# Altium schematic sheet EVK-IRIS-W1-FC2_FC3_FC14_RMII.SchDoc
size A3; DocumentNumber: 5; SheetNumber: 5; SheetTotal: 14
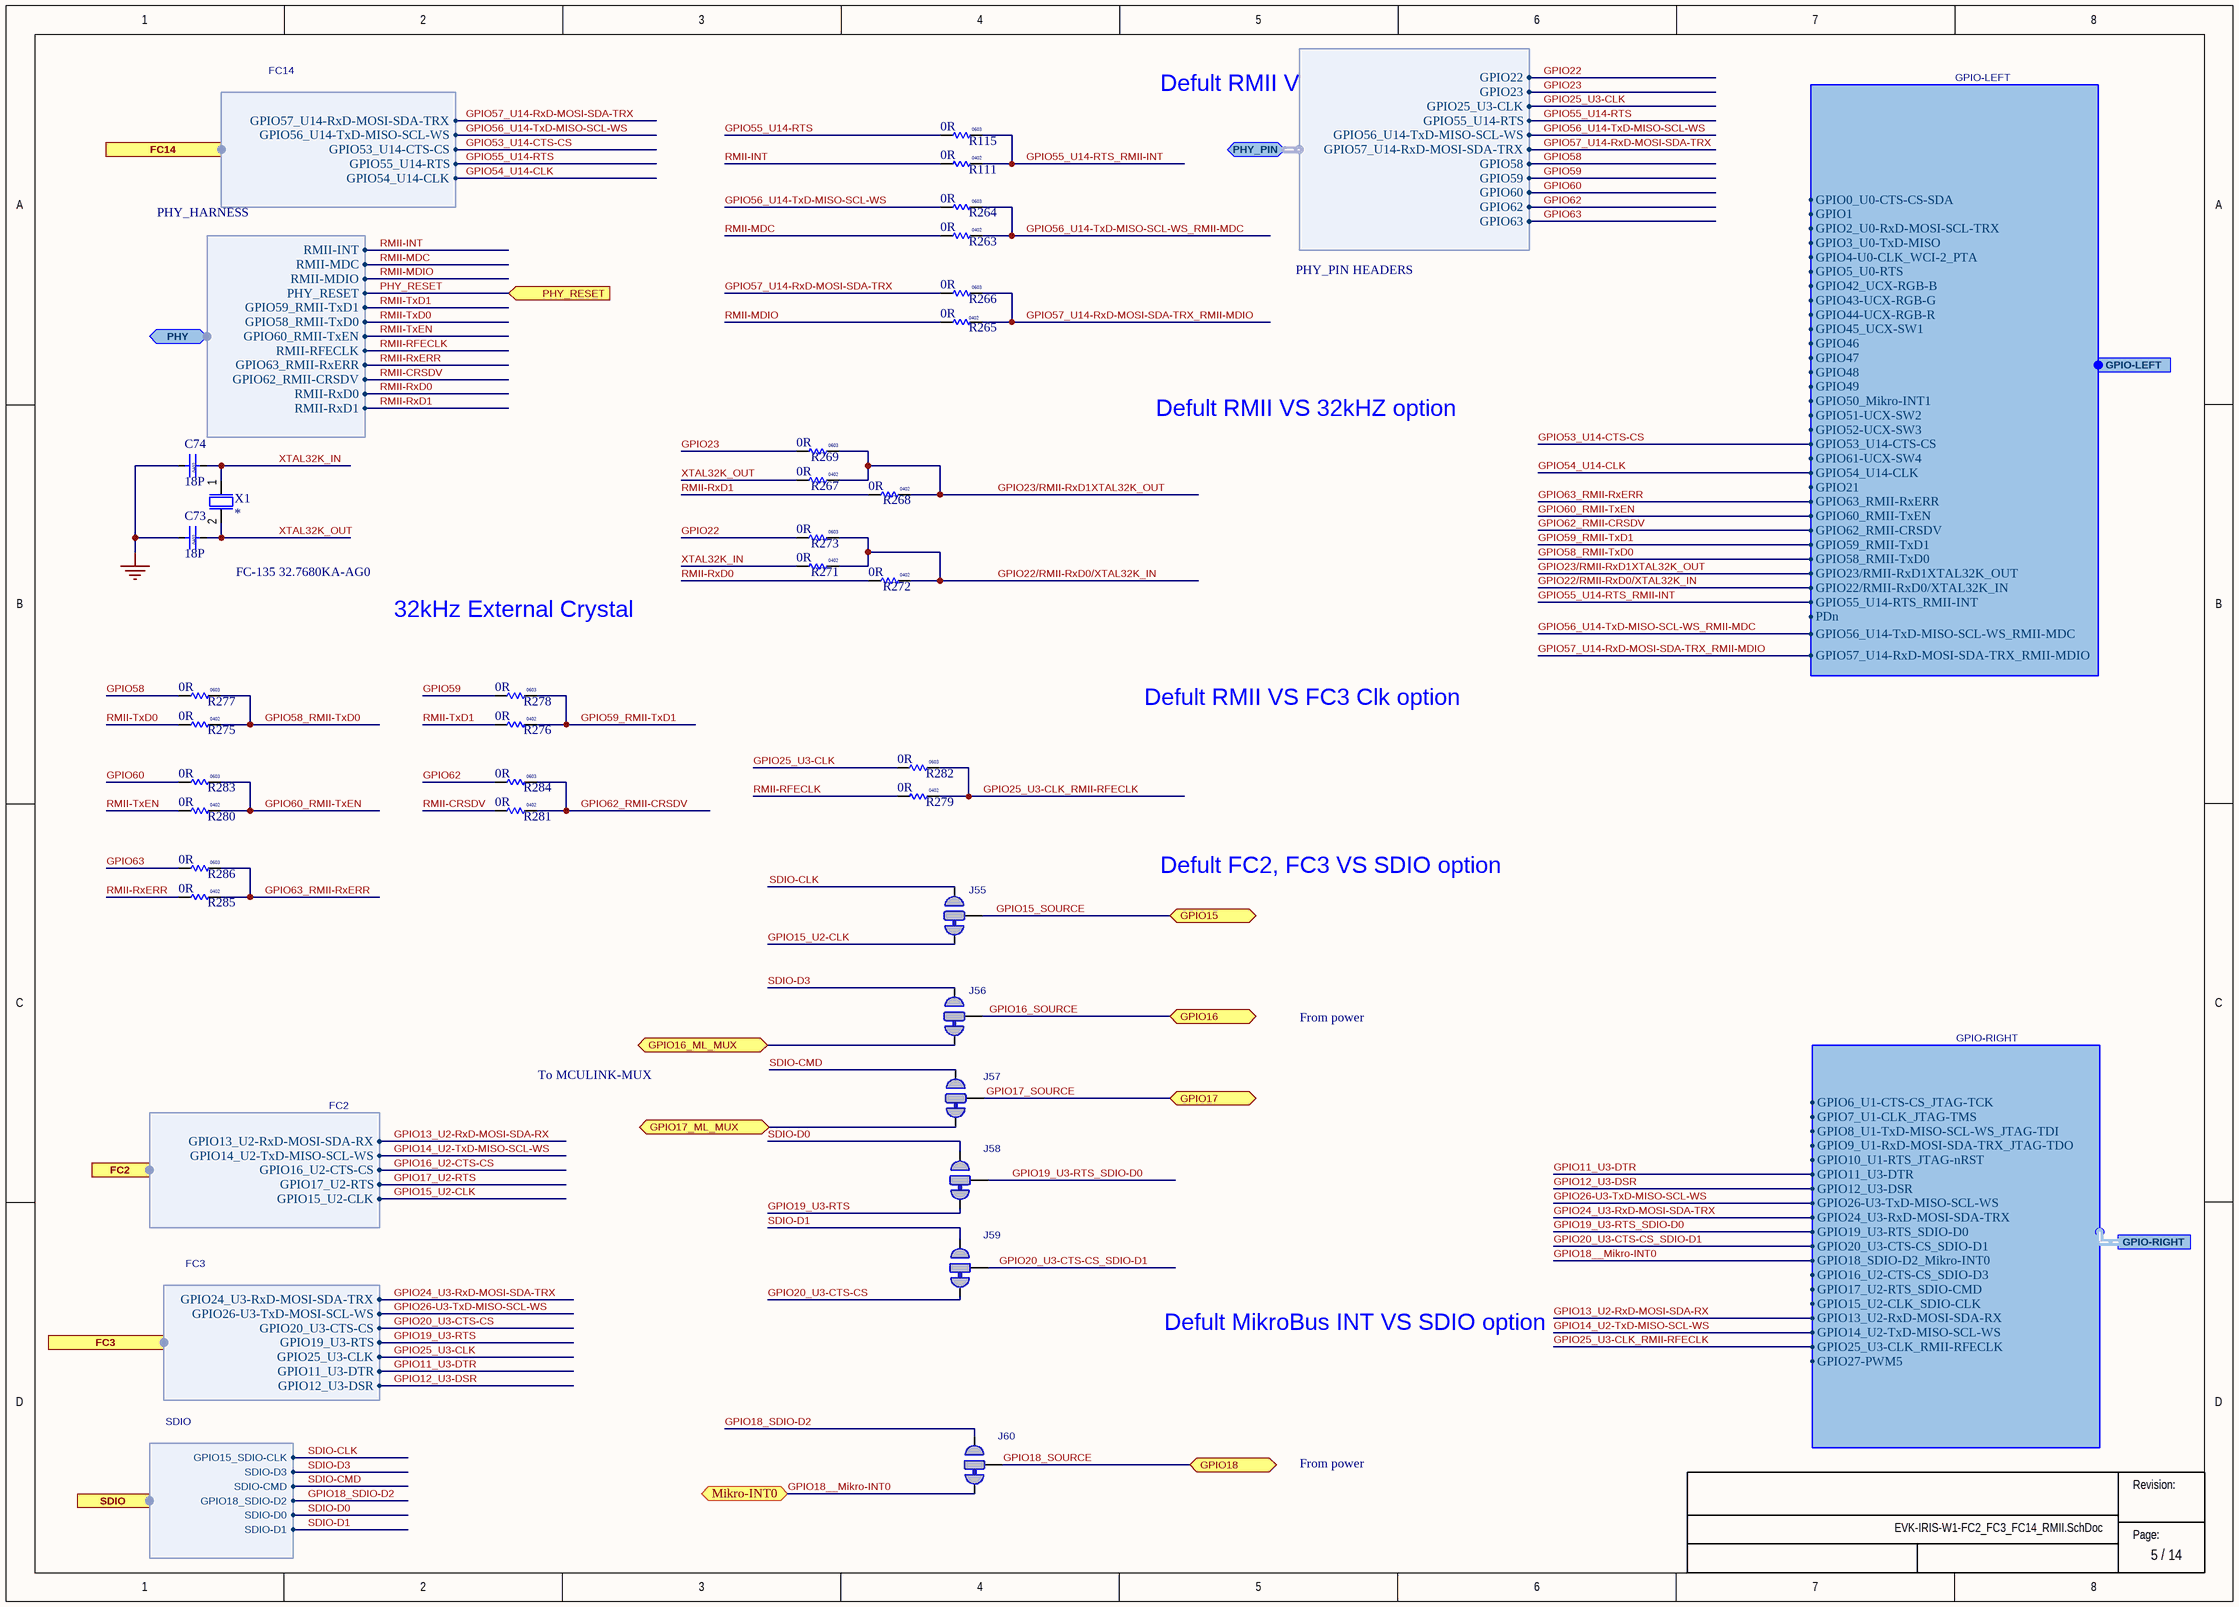
[diagram p0: EVK-IRIS-W1-FC2_FC3_FC14_RMII.SchDoc]

## Parts
C73  value 18P  Size: 0402  [Cap 0402]
C74  value 18P  Size: 0402  [Cap 0402]
J55  Solderbridge-OptionDNP  [Solderbridge-Option]  (value not drawn)  (net tie, no BOM)
J56  Solderbridge-OptionDNP  [Solderbridge-Option]  (value not drawn)  (net tie, no BOM)
J57  Solderbridge-OptionDNP  [Solderbridge-Option]  (value not drawn)  (net tie, no BOM)
J58  Solderbridge-OptionDNP  [Solderbridge-Option]  (value not drawn)  (net tie, no BOM)
J59  Solderbridge-OptionDNP  [Solderbridge-Option]  (value not drawn)  (net tie, no BOM)
J60  Solderbridge-OptionDNP  [Solderbridge-Option]  (value not drawn)  (net tie, no BOM)
R111  value 0R  Size: 0402  [RES 0402 HD]
R115  value 0R  Size: 0603  [RES 0603 HD]
R263  value 0R  Size: 0402  [RES 0402 HD]
R264  value 0R  Size: 0603  [RES 0603 HD]
R265  value 0R  Size: 0402  [RES 0402 HD]
R266  value 0R  Size: 0603  [RES 0603 HD]
R267  value 0R  Size: 0402  [RES 0402 HD]
R268  value 0R  Size: 0402  [RES 0402 HD]
R269  value 0R  Size: 0603  [RES 0603 HD]
R271  value 0R  Size: 0402  [RES 0402 HD]
R272  value 0R  Size: 0402  [RES 0402 HD]
R273  value 0R  Size: 0603  [RES 0603 HD]
R275  value 0R  Size: 0402  [RES 0402 HD]
R276  value 0R  Size: 0402  [RES 0402 HD]
R277  value 0R  Size: 0603  [RES 0603 HD]
R278  value 0R  Size: 0603  [RES 0603 HD]
R279  value 0R  Size: 0402  [RES 0402 HD]
R280  value 0R  Size: 0402  [RES 0402 HD]
R281  value 0R  Size: 0402  [RES 0402 HD]
R282  value 0R  Size: 0603  [RES 0603 HD]
R283  value 0R  Size: 0603  [RES 0603 HD]
R284  value 0R  Size: 0603  [RES 0603 HD]
R285  value 0R  Size: 0402  [RES 0402 HD]
R286  value 0R  Size: 0603  [RES 0603 HD]
X1  (no value)  [XTAL_3215]

## Ports
FC2 (harness FC2), FC3 (harness FC3), FC14 (harness FC14), GPIO15 (bidir), GPIO16 (bidir), GPIO16_ML_MUX (bidir), GPIO17 (bidir), GPIO17_ML_MUX (bidir), GPIO18 (bidir), GPIO-LEFT (harness GPIO-LEFT), GPIO-RIGHT (harness GPIO-RIGHT), Mikro-INT0 (bidir), PHY (bidir, harness PHY_HARNESS), PHY_PIN (bidir, harness PHY_PIN HEADERS), PHY_RESET (in), SDIO (harness SDIO)

## Harnesses
GPIO-RIGHT: GPIO6_U1-CTS-CS_JTAG-TCK, GPIO7_U1-CLK_JTAG-TMS, GPIO8_U1-TxD-MISO-SCL-WS_JTAG-TDI, GPIO9_U1-RxD-MOSI-SDA-TRX_JTAG-TDO, GPIO10_U1-RTS_JTAG-nRST, GPIO11_U3-DTR, GPIO12_U3-DSR, GPIO26-U3-TxD-MISO-SCL-WS, GPIO24_U3-RxD-MOSI-SDA-TRX, GPIO19_U3-RTS_SDIO-D0, GPIO20_U3-CTS-CS_SDIO-D1, GPIO18_SDIO-D2_Mikro-INT0, GPIO16_U2-CTS-CS_SDIO-D3, GPIO17_U2-RTS_SDIO-CMD, GPIO15_U2-CLK_SDIO-CLK, GPIO13_U2-RxD-MOSI-SDA-RX, GPIO14_U2-TxD-MISO-SCL-WS, GPIO25_U3-CLK_RMII-RFECLK, GPIO27-PWM5
PHY_HARNESS: RMII-MDIO, RMII-MDC, PHY_RESET, RMII-INT, GPIO59_RMII-TxD1, GPIO58_RMII-TxD0, GPIO60_RMII-TxEN, RMII-RFECLK, GPIO63_RMII-RxERR, GPIO62_RMII-CRSDV, RMII-RxD0, RMII-RxD1
FC14: GPIO57_U14-RxD-MOSI-SDA-TRX, GPIO56_U14-TxD-MISO-SCL-WS, GPIO53_U14-CTS-CS, GPIO55_U14-RTS, GPIO54_U14-CLK
SDIO: GPIO15_SDIO-CLK, SDIO-D3, SDIO-CMD, GPIO18_SDIO-D2, SDIO-D0, SDIO-D1
FC2: GPIO13_U2-RxD-MOSI-SDA-RX, GPIO14_U2-TxD-MISO-SCL-WS, GPIO16_U2-CTS-CS, GPIO17_U2-RTS, GPIO15_U2-CLK
FC3: GPIO20_U3-CTS-CS, GPIO19_U3-RTS, GPIO24_U3-RxD-MOSI-SDA-TRX, GPIO26-U3-TxD-MOSI-SCL-WS, GPIO25_U3-CLK, GPIO11_U3-DTR, GPIO12_U3-DSR
GPIO-LEFT: GPIO0_U0-CTS-CS-SDA, GPIO1, GPIO2_U0-RxD-MOSI-SCL-TRX, GPIO3_U0-TxD-MISO, GPIO4-U0-CLK_WCI-2_PTA, GPIO5_U0-RTS, GPIO42_UCX-RGB-B, GPIO43-UCX-RGB-G, GPIO44-UCX-RGB-R, GPIO45_UCX-SW1, GPIO46, GPIO47, GPIO48, GPIO49, GPIO50_Mikro-INT1, GPIO51-UCX-SW2, GPIO52-UCX-SW3, GPIO53_U14-CTS-CS, GPIO61-UCX-SW4, GPIO54_U14-CLK, GPIO21, GPIO63_RMII-RxERR, GPIO60_RMII-TxEN, GPIO62_RMII-CRSDV, GPIO59_RMII-TxD1, GPIO58_RMII-TxD0, GPIO23/RMII-RxD1XTAL32K_OUT, GPIO22/RMII-RxD0/XTAL32K_IN, GPIO55_U14-RTS_RMII-INT, PDn, GPIO56_U14-TxD-MISO-SCL-WS_RMII-MDC, GPIO57_U14-RxD-MOSI-SDA-TRX_RMII-MDIO
PHY_PIN HEADERS: GPIO22, GPIO23, GPIO25_U3-CLK, GPIO55_U14-RTS, GPIO56_U14-TxD-MISO-SCL-WS, GPIO57_U14-RxD-MOSI-SDA-TRX, GPIO58, GPIO59, GPIO60, GPIO62, GPIO63

## Nets
GND: C73.2 C74.2
GPIO11_U3-DTR: port GPIO-RIGHT.GPIO11_U3-DTR, port FC3.GPIO11_U3-DTR
GPIO12_U3-DSR: port GPIO-RIGHT.GPIO12_U3-DSR, port FC3.GPIO12_U3-DSR
GPIO13_U2-RxD-MOSI-SDA-RX: port GPIO-RIGHT.GPIO13_U2-RxD-MOSI-SDA-RX, port FC2.GPIO13_U2-RxD-MOSI-SDA-RX
GPIO14_U2-TxD-MISO-SCL-WS: port GPIO-RIGHT.GPIO14_U2-TxD-MISO-SCL-WS, port FC2.GPIO14_U2-TxD-MISO-SCL-WS
GPIO15_SOURCE: J55.2 ; port GPIO15
GPIO15_U2-CLK: J55.1 ; port FC2.GPIO15_U2-CLK
GPIO16_ML_MUX: J56.1 ; port GPIO16_ML_MUX
GPIO16_SOURCE: J56.2 ; port GPIO16
GPIO16_U2-CTS-CS: port FC2.GPIO16_U2-CTS-CS
GPIO17_ML_MUX: J57.1 ; port GPIO17_ML_MUX
GPIO17_SOURCE: J57.2 ; port GPIO17
GPIO17_U2-RTS: port FC2.GPIO17_U2-RTS
GPIO18__Mikro-INT0: J60.1 ; port Mikro-INT0, port GPIO-RIGHT.GPIO18_SDIO-D2_Mikro-INT0
GPIO18_SDIO-D2: J60.3 ; port SDIO.GPIO18_SDIO-D2
GPIO18_SOURCE: J60.2 ; port GPIO18
GPIO19_U3-RTS: J58.1 ; port FC3.GPIO19_U3-RTS
GPIO19_U3-RTS_SDIO-D0: J58.2 ; port GPIO-RIGHT.GPIO19_U3-RTS_SDIO-D0
GPIO20_U3-CTS-CS: J59.1 ; port FC3.GPIO20_U3-CTS-CS
GPIO20_U3-CTS-CS_SDIO-D1: J59.2 ; port GPIO-RIGHT.GPIO20_U3-CTS-CS_SDIO-D1
GPIO22: R273.1 ; port PHY_PIN.GPIO22
GPIO22/RMII-RxD0/XTAL32K_IN: R271.2 R272.2 R273.2 ; port GPIO-LEFT.GPIO22/RMII-RxD0/XTAL32K_IN
GPIO23: R269.1 ; port PHY_PIN.GPIO23
GPIO23/RMII-RxD1XTAL32K_OUT: R267.2 R268.2 R269.2 ; port GPIO-LEFT.GPIO23/RMII-RxD1XTAL32K_OUT
GPIO24_U3-RxD-MOSI-SDA-TRX: port GPIO-RIGHT.GPIO24_U3-RxD-MOSI-SDA-TRX, port FC3.GPIO24_U3-RxD-MOSI-SDA-TRX
GPIO25_U3-CLK: R282.1 ; port FC3.GPIO25_U3-CLK, port PHY_PIN.GPIO25_U3-CLK
GPIO25_U3-CLK_RMII-RFECLK: R279.2 R282.2 ; port GPIO-RIGHT.GPIO25_U3-CLK_RMII-RFECLK
GPIO26-U3-TxD-MISO-SCL-WS: port GPIO-RIGHT.GPIO26-U3-TxD-MISO-SCL-WS, port FC3.GPIO26-U3-TxD-MOSI-SCL-WS
GPIO53_U14-CTS-CS: port FC14.GPIO53_U14-CTS-CS, port GPIO-LEFT.GPIO53_U14-CTS-CS
GPIO54_U14-CLK: port FC14.GPIO54_U14-CLK, port GPIO-LEFT.GPIO54_U14-CLK
GPIO55_U14-RTS: R115.1 ; port FC14.GPIO55_U14-RTS, port PHY_PIN.GPIO55_U14-RTS
GPIO55_U14-RTS_RMII-INT: R111.2 R115.2 ; port GPIO-LEFT.GPIO55_U14-RTS_RMII-INT
GPIO56_U14-TxD-MISO-SCL-WS: R264.1 ; port FC14.GPIO56_U14-TxD-MISO-SCL-WS, port PHY_PIN.GPIO56_U14-TxD-MISO-SCL-WS
GPIO56_U14-TxD-MISO-SCL-WS_RMII-MDC: R263.2 R264.2 ; port GPIO-LEFT.GPIO56_U14-TxD-MISO-SCL-WS_RMII-MDC
GPIO57_U14-RxD-MOSI-SDA-TRX: R266.1 ; port FC14.GPIO57_U14-RxD-MOSI-SDA-TRX, port PHY_PIN.GPIO57_U14-RxD-MOSI-SDA-TRX
GPIO57_U14-RxD-MOSI-SDA-TRX_RMII-MDIO: R265.2 R266.2 ; port GPIO-LEFT.GPIO57_U14-RxD-MOSI-SDA-TRX_RMII-MDIO
GPIO58: R277.1 ; port PHY_PIN.GPIO58
GPIO58_RMII-TxD0: R275.2 R277.2 ; port GPIO-LEFT.GPIO58_RMII-TxD0
GPIO59: R278.1 ; port PHY_PIN.GPIO59
GPIO59_RMII-TxD1: R276.2 R278.2 ; port GPIO-LEFT.GPIO59_RMII-TxD1
GPIO60: R283.1 ; port PHY_PIN.GPIO60
GPIO60_RMII-TxEN: R280.2 R283.2 ; port GPIO-LEFT.GPIO60_RMII-TxEN
GPIO62: R284.1 ; port PHY_PIN.GPIO62
GPIO62_RMII-CRSDV: R281.2 R284.2 ; port GPIO-LEFT.GPIO62_RMII-CRSDV
GPIO63: R286.1 ; port PHY_PIN.GPIO63
GPIO63_RMII-RxERR: R285.2 R286.2 ; port GPIO-LEFT.GPIO63_RMII-RxERR
PHY_RESET: port PHY_RESET, port PHY.PHY_RESET
RMII-CRSDV: R281.1 ; port PHY.GPIO62_RMII-CRSDV
RMII-INT: R111.1 ; port PHY.RMII-INT
RMII-MDC: R263.1 ; port PHY.RMII-MDC
RMII-MDIO: R265.1 ; port PHY.RMII-MDIO
RMII-RFECLK: R279.1 ; port PHY.RMII-RFECLK
RMII-RxD0: R272.1 ; port PHY.RMII-RxD0
RMII-RxD1: R268.1 ; port PHY.RMII-RxD1
RMII-RxERR: R285.1 ; port PHY.GPIO63_RMII-RxERR
RMII-TxD0: R275.1 ; port PHY.GPIO58_RMII-TxD0
RMII-TxD1: R276.1 ; port PHY.GPIO59_RMII-TxD1
RMII-TxEN: R280.1 ; port PHY.GPIO60_RMII-TxEN
SDIO-CLK: J55.3 ; port SDIO.GPIO15_SDIO-CLK
SDIO-CMD: J57.3 ; port SDIO.SDIO-CMD
SDIO-D0: J58.3 ; port SDIO.SDIO-D0
SDIO-D1: J59.3 ; port SDIO.SDIO-D1
SDIO-D3: J56.3 ; port SDIO.SDIO-D3
XTAL32K_IN: C74.1 R271.1 X1.1
XTAL32K_OUT: C73.1 R267.1 X1.2

## Notes on the sheet
- (near R115) Defult RMII VS FC14 option
- (near R269) Defult RMII VS 32kHZ option
- FC-135 32.7680KA-AG0
- 32kHz External Crystal
- Defult RMII VS FC3 Clk option
- (near J55) Defult FC2, FC3 VS SDIO option
- From power
- To MCULINK-MUX
- (near J59) Defult MikroBus INT VS SDIO option
- Revision:
- Page:

## Library data of the parts
C73 C74 = UBXH01-0004017: CAP CER C0G 0402 18P 5% 25V; Manufacturer: Murata Manufacturing Company, Ltd.; Manufacturer P/N: GRM1555C1H180JA01; Editor: doris.zahnd; Released by: daniel.hurni; Env: ROHS; Permitted Use: Volume Products; Perferred: PREF; Mfg P/N Status: NRND; Mfg P/N Split: 100; Mfg P/N Released: Yes; Part Number: UBXH01-0004017; Tolerance: 5%; Max Voltage: 25V; Min Operating Temp: -55°C; Max Operating Temp: 125°C; Part Type: Capacitor; Release Data: 2009-12-03T17:48:42; UBX Wiki: https://wiki.u-blox.com/bin/view/Operations/PartDetails?index=5178; RefDes: C; Manufacturer 2: Murata Manufacturing Company, Ltd.; Manufacturer P/N 2: GRM1555C1E180JZ01; Mfg P/N Status 2: Obsolete; Mfg P/N Split 2: 0; Mfg P/N Released 2: Yes; Manufacturer 3: Murata Manufacturing Company, Ltd.; Manufacturer P/N 3: GRM1555C1H180JZ01; Mfg P/N Status 3: Obsolete; Mfg P/N Split 3: 0; Mfg P/N Released 3: Yes
J55-J60 = Solderbridge-Option: Added By: Paul B; Part Number: Solderbridge-Option; Height: 0; DNP: DNP; Added Date: 12/3/2015
R111 R263 R265 R267 R268 R271 R272 R275 R276 R279-R281 R285 = UBXH18-0003002: RES THICK FILM CHIP 0402 0R 0 100mW; Manufacturer: KOA; Manufacturer P/N: RK73Z1ETTD; Tolerance: 0; Editor: charlotte.biber; Released by: peter.mueller; Env: ROHS; Permitted Use: Volume Products; Perferred: PREF; Mfg P/N Status: NRND; Mfg P/N Split: 100; Mfg P/N Released: Yes; Part Number: UBXH18-0003002; Manufacturer 2: YAGEO; Max Power: 100mW; Part Type: Resistor; Release Data: 2012-06-05T09:49:55; UBX Wiki: https://wiki.u-blox.com/bin/view/Operations/PartDetails?index=6611; RefDes: R; Manufacturer P/N 2: 2322_705_91001_L; Mfg P/N Status 2: NRND; Mfg P/N Split 2: 0; Mfg P/N Released 2: Yes
R115 R264 R266 R269 R273 R277 R278 R282-R284 R286 = UBXH18-0003001: RES THICK FILM CHIP 0603 0R 0 100mW; Manufacturer: YAGEO; Manufacturer P/N: RC0603JR-070RL; Tolerance: 0; Editor: martin.frauchiger; Env: ROHS; Permitted Use: Volume Products; Perferred: PREF; Mfg P/N Status: Active; Mfg P/N Split: 100; Mfg P/N Released: Yes; Part Number: UBXH18-0003001; Max Power: 100mW; Part Type: Resistor; Released by: martin.frauchiger; Release Data: 2005-07-14T10:55:51; UBX Wiki: https://wiki.u-blox.com/bin/view/Operations/PartDetails?index=6609; RefDes: R
X1 = 100-00005: XTAL, 2Pin, 32.768kHz, 7pF 20ppm; Part Name: XTAL 32.768kHz 7pF 20ppm 3215; Manufacturer 1: AVX Corporation; Manufacturer Part Number 1: ST3215SB32768C0HPWBB; Body Size: 3.2mm x 1.5mm; MFG Package: 2-SMD; Use in new designs: Yes; UBX Code: None; Item Phase: In Production; Manufacturer P/N: *; Part Number: 100-00005; Revision: 0C; Supplier 1: Digi-Key; Supplier Part Number 1: 1253-1113-1-ND; Manufacturer 2: Epson; Supplier 2: Digi-Key; Supplier Part Number 2: SER4086CT-ND; Height: 0.9mm; Pins: 2; Max Operating Temp: 85; Voltage: None; Manufacturer Part Number 2: FC-135 32.7680KA-AG3; Min Operating Temp: -40